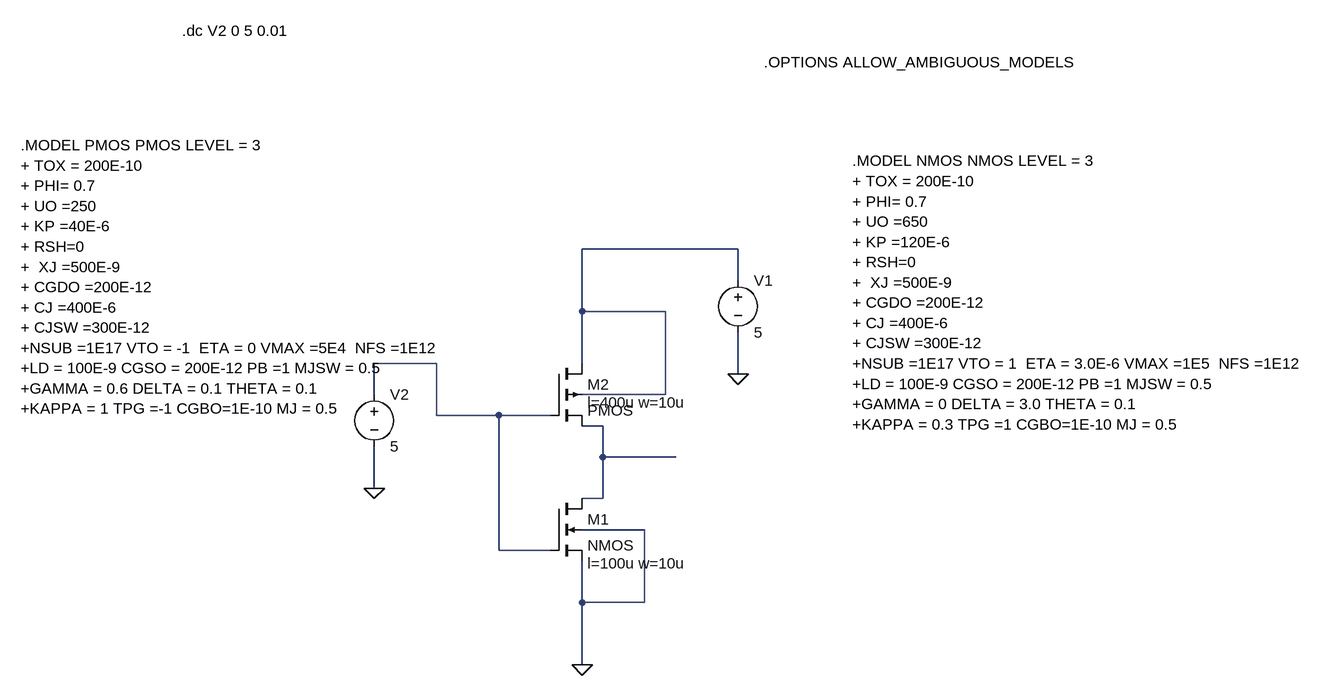
[diagram p0: schematic CMOS Inverter.asc]
CMOS Inverter.asc, the LTspice schematic file:
Version 4.1
SHEET 1 1300 680
WIRE 400 -320 160 -320
WIRE 400 -272 400 -320
WIRE 160 -224 160 -320
WIRE 288 -224 160 -224
WIRE -64 -144 -160 -144
WIRE 160 -144 160 -224
WIRE 400 -128 400 -192
WIRE -160 -96 -160 -144
WIRE 288 -96 288 -224
WIRE 288 -96 160 -96
WIRE -64 -64 -64 -144
WIRE 32 -64 -64 -64
WIRE 112 -64 32 -64
WIRE 192 -48 160 -48
WIRE 192 0 192 -48
WIRE 304 0 192 0
WIRE -160 48 -160 -16
WIRE 192 64 192 0
WIRE 192 64 160 64
WIRE 256 112 160 112
WIRE 32 144 32 -64
WIRE 112 144 32 144
WIRE 160 224 160 160
WIRE 256 224 256 112
WIRE 256 224 160 224
WIRE 160 320 160 224
FLAG 160 320 0
FLAG -160 48 0
FLAG 400 -128 0
SYMBOL nmos4 112 64 R0
WINDOW 123 56 100 Left 2
SYMATTR Value2 l=100u w=10u
SYMATTR InstName M1
SYMBOL pmos4 112 -144 R0
WINDOW 123 56 60 Left 2
SYMATTR Value2 l=400u w=10u
SYMATTR InstName M2
SYMBOL voltage 400 -288 R0
WINDOW 123 0 0 Left 0
WINDOW 39 0 0 Left 0
SYMATTR InstName V1
SYMATTR Value 5
SYMBOL voltage -160 -112 R0
WINDOW 123 0 0 Left 0
WINDOW 39 0 0 Left 0
SYMATTR InstName V2
SYMATTR Value 5
TEXT 576 -456 Left 2 !.MODEL NMOS NMOS LEVEL = 3\n+ TOX = 200E-10\n+ PHI= 0.7\n+ UO =650\n+ KP =120E-6\n+ RSH=0\n+  XJ =500E-9\n+ CGDO =200E-12\n+ CJ =400E-6\n+ CJSW =300E-12\n+NSUB =1E17 VTO = 1  ETA = 3.0E-6 VMAX =1E5  NFS =1E12\n+LD = 100E-9 CGSO = 200E-12 PB =1 MJSW = 0.5\n+GAMMA = 0 DELTA = 3.0 THETA = 0.1\n+KAPPA = 0.3 TPG =1 CGBO=1E-10 MJ = 0.5
TEXT -704 -480 Left 2 !.MODEL PMOS PMOS LEVEL = 3\n+ TOX = 200E-10\n+ PHI= 0.7\n+ UO =250\n+ KP =40E-6\n+ RSH=0\n+  XJ =500E-9\n+ CGDO =200E-12\n+ CJ =400E-6\n+ CJSW =300E-12\n+NSUB =1E17 VTO = -1  ETA = 0 VMAX =5E4  NFS =1E12\n+LD = 100E-9 CGSO = 200E-12 PB =1 MJSW = 0.5\n+GAMMA = 0.6 DELTA = 0.1 THETA = 0.1\n+KAPPA = 1 TPG =-1 CGBO=1E-10 MJ = 0.5
TEXT -456 -656 Left 2 !.dc V2 0 5 0.01
TEXT 440 -608 Left 2 !.OPTIONS ALLOW_AMBIGUOUS_MODELS

The netlist it stands for:
* CMOS Inverter.asc
M1 N003 N002 0 0 NMOS l=100u w=10u
M2 N001 N002 N003 N001 PMOS l=400u w=10u
V1 N001 0 5
V2 N002 0 5
.model NMOS NMOS
.model PMOS PMOS
.lib standard.mos
.MODEL NMOS NMOS LEVEL = 3
+ TOX = 200E-10
+ PHI= 0.7
+ UO =650
+ KP =120E-6
+ RSH=0
+  XJ =500E-9
+ CGDO =200E-12
+ CJ =400E-6
+ CJSW =300E-12
+NSUB =1E17 VTO = 1  ETA = 3.0E-6 VMAX =1E5  NFS =1E12
+LD = 100E-9 CGSO = 200E-12 PB =1 MJSW = 0.5
+GAMMA = 0 DELTA = 3.0 THETA = 0.1
+KAPPA = 0.3 TPG =1 CGBO=1E-10 MJ = 0.5
.MODEL PMOS PMOS LEVEL = 3
+ TOX = 200E-10
+ PHI= 0.7
+ UO =250
+ KP =40E-6
+ RSH=0
+  XJ =500E-9
+ CGDO =200E-12
+ CJ =400E-6
+ CJSW =300E-12
+NSUB =1E17 VTO = -1  ETA = 0 VMAX =5E4  NFS =1E12
+LD = 100E-9 CGSO = 200E-12 PB =1 MJSW = 0.5
+GAMMA = 0.6 DELTA = 0.1 THETA = 0.1
+KAPPA = 1 TPG =-1 CGBO=1E-10 MJ = 0.5
.dc V2 0 5 0.01
.OPTIONS ALLOW_AMBIGUOUS_MODELS
.backanno
.end